# Altium project EncoderBoard2021.PrjPCB
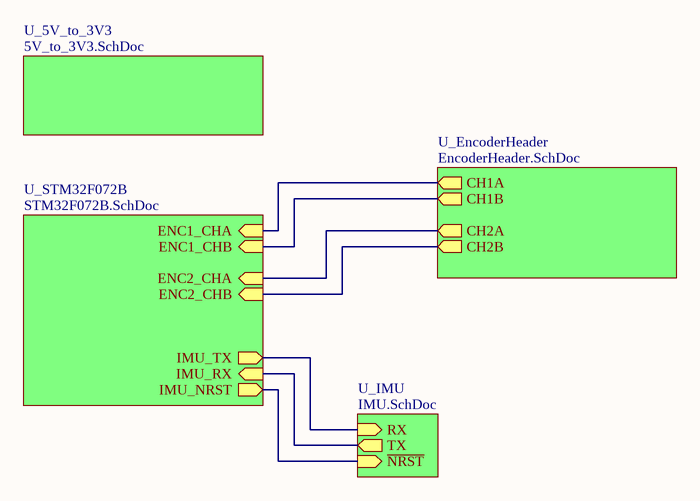
[diagram p0: EncoderBoard2020.SchDoc]
5 sheets, 39 parts. Net scope: hierarchical (ports join the sheet entries above them; power ports are global).
Board files: ENCBoard_rectangle.PcbDoc, pcb1.PcbDoc
Sheets:
  EncoderBoard2020.SchDoc
    U_5V_to_3V3 = 5V_to_3V3.SchDoc
    U_STM32F072B = STM32F072B.SchDoc
    U_EncoderHeader = EncoderHeader.SchDoc
    U_IMU = IMU.SchDoc

## Sheet EncoderBoard2020.SchDoc
size A4

### Sub-sheets
U_5V_to_3V3 = 5V_to_3V3.SchDoc: no entries
U_EncoderHeader = EncoderHeader.SchDoc: CH1B (out), CH1A (out), CH2B (out), CH2A (out)
U_IMU = IMU.SchDoc: TX (out), RX (in), ~{NRST} (in)
U_STM32F072B = STM32F072B.SchDoc: ENC1_CHA (in), ENC1_CHB (in), ENC2_CHA (in), ENC2_CHB (in), IMU_NRST (out), IMU_RX (in), IMU_TX (out)

### Nets
ENC1_CHA: sheet U_STM32F072B/ENC1_CHA, sheet U_EncoderHeader/CH1A
ENC1_CHB: sheet U_STM32F072B/ENC1_CHB, sheet U_EncoderHeader/CH1B
ENC2_CHA: sheet U_STM32F072B/ENC2_CHA, sheet U_EncoderHeader/CH2A
ENC2_CHB: sheet U_STM32F072B/ENC2_CHB, sheet U_EncoderHeader/CH2B
~{NRST}: sheet U_STM32F072B/IMU_NRST, sheet U_IMU/~{NRST}
UART2_RX: sheet U_STM32F072B/IMU_RX, sheet U_IMU/TX
UART2_TX: sheet U_STM32F072B/IMU_TX, sheet U_IMU/RX

## Sheet 5V_to_3V3.SchDoc
size A4
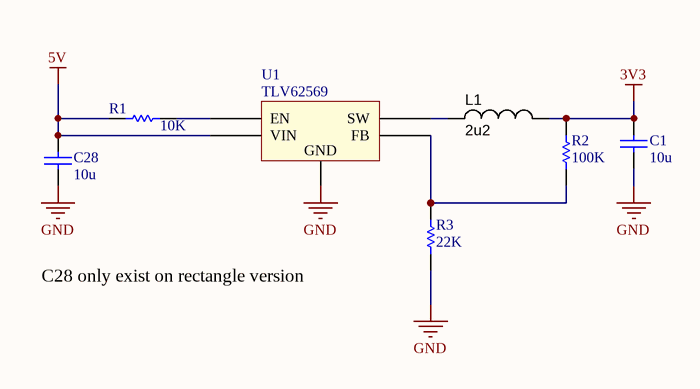
[diagram p1: 5V_to_3V3.SchDoc]

### Parts
C1  value 10u  [CAPC2012X135N]  (hidden comment: Cap)
C28  value 10u  [CAPC2012X135N]  (hidden comment: Cap)
L1  value 2u2  [INDM3225X240N]  (hidden comment: inductor)
R1  value 10K  [RESC1608X55N]  (hidden comment: Res1)
R2  value 100K  [RESC2012X70N]  (hidden comment: Res1)
R3  value 22K  [RESC2012X70N]  (hidden comment: Res1)
U1  TLV62569  [SOT23-5]

### Nets
3V3: C1.2 L1.2 R2.2
5V: C28.2 R1.1 U1.4(VIN)
GND: C1.1 C28.1 R3.2 U1.2(GND)
NetL1_1: L1.1 U1.3(SW)
NetR1_2: R1.2 U1.1(EN)
NetR2_1: R2.1 R3.1 U1.5(FB)

### Notes on the sheet
- C28 only exist on rectangle version

### Library data of the parts
C1 C28 = Cap: Capacitor; Published: 8-Jun-2000; LatestRevisionDate: 17-Jul-2002; LatestRevisionNote: Re-released for DXP Platform.; PackageReference: RAD-0.3; Publisher: Altium Limited; PackageDescription: Radial Cap, Thru-Hole; 2 Leads; 0.3 in Pin Spacing
L1 = INDC: IHLP SMD 4040; link: http://www.mouser.hk/ProductDetail/Panasonic/ETQ-P5M4R7YFC/?qs=sGAEpiMZZMsg%252by3WlYCkUx1BJssUTVH58rrEHsPkNus%3d
R1-R3 = Res1: Resistor; Published: 8-Jun-2000; LatestRevisionDate: 17-Jul-2002; LatestRevisionNote: Re-released for DXP Platform.; PackageReference: AXIAL-0.3; Publisher: Altium Limited; PackageDescription: Axial Device, Thru-Hole; 2 Leads; 0.3 in Pin Spacing
U1 = TLV62569: 2-A High Efficiency Synchronous Buck Converter in SOT Package; Manufacturer: TI; Vin: 2.5-5.5V; Iout(max): 2A

## Sheet STM32F072B.SchDoc
size A4
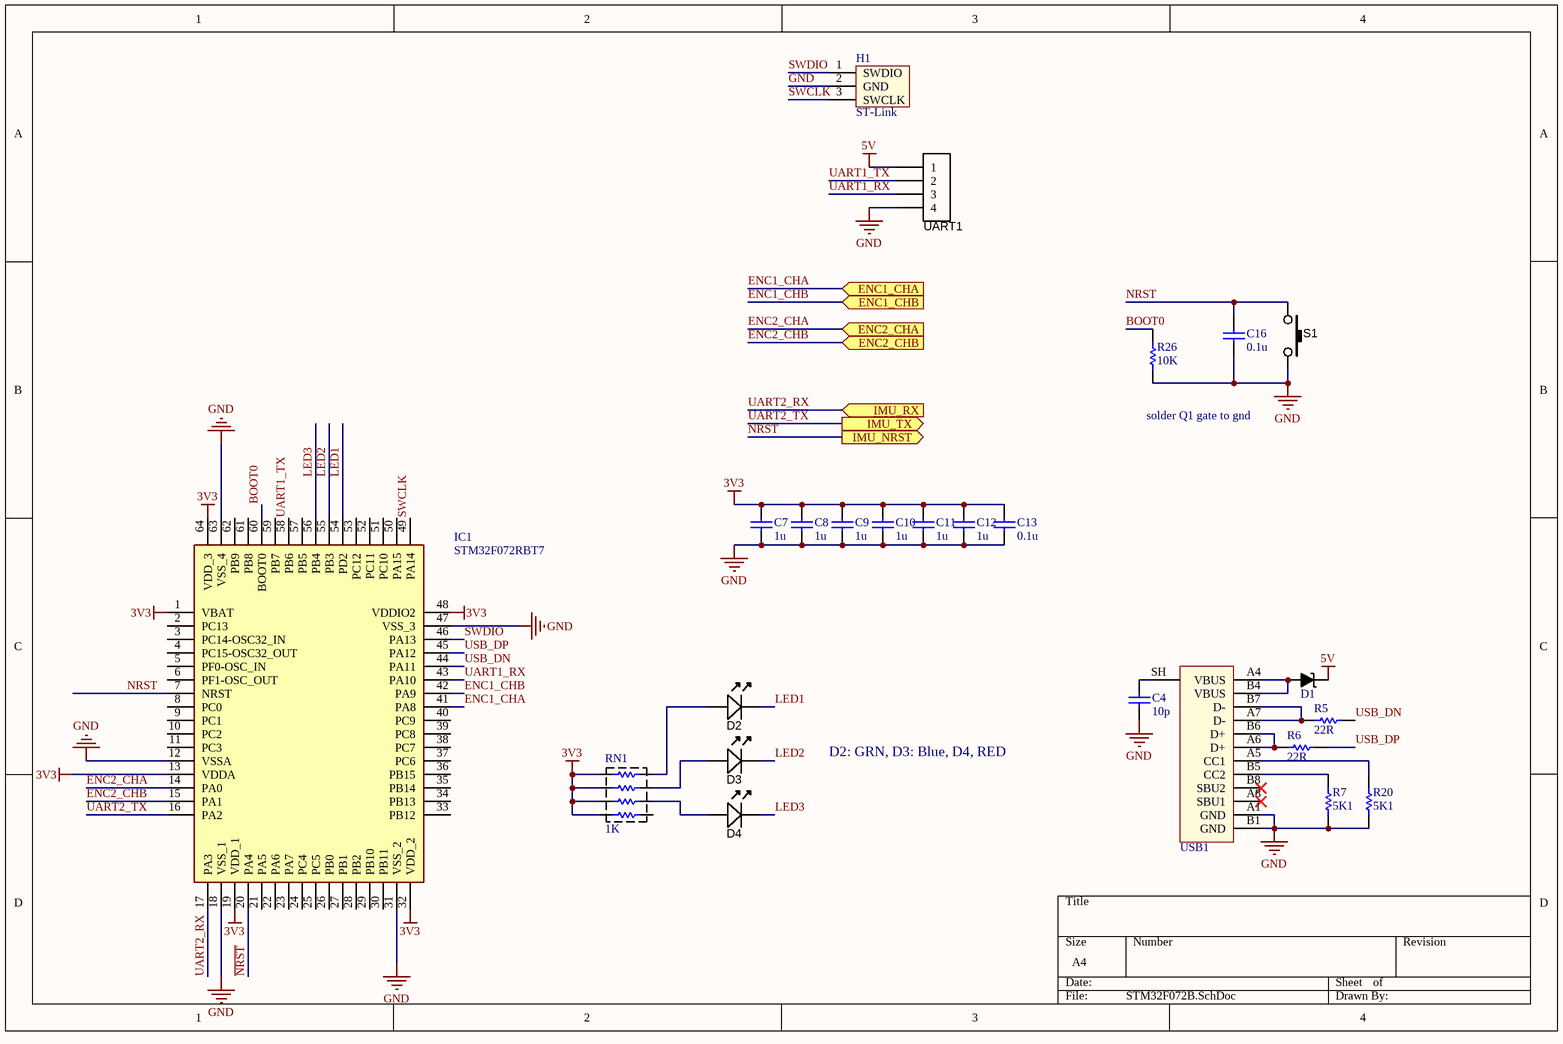
[diagram p2: STM32F072B.SchDoc]

### Parts
C4  value 10p  [CAPC1608X90N]  (hidden comment: Cap)
C7  value 1u  [CAPC1608X90N]  (hidden comment: Cap)
C8  value 1u  [CAPC1608X90N]  (hidden comment: Cap)
C9  value 1u  [CAPC1608X90N]  (hidden comment: Cap)
C10  value 1u  [CAPC1608X90N]  (hidden comment: Cap)
C11  value 1u  [CAPC1608X90N]  (hidden comment: Cap)
C12  value 1u  [CAPC1608X90N]  (hidden comment: Cap)
C13  value 0.1u  [CAPC1608X90N]  (hidden comment: Cap)
C16  value 0.1u  [CAPC1608X90N]  (hidden comment: Cap)
D1  diode  [DIODE_3216_70N]  (value not drawn)
D2  LED_Green_GullWing  [LED-0805-A]  (value not drawn)
D3  LED_Green_GullWing  [LED-0805-A]  (value not drawn)
D4  LED_Green_GullWing  [LED-0805-A]  (value not drawn)
H1  ST-Link  [ST-Link]
IC1  STM32F072RBT7  [QFP50P1200X1200X160-64N]
R5  value 22R  [RESC1608X55N]  (hidden comment: Res1)
R6  value 22R  [RESC1608X55N]  (hidden comment: Res1)
R7  value 5K1  [RESC1608X55N]  (hidden comment: Res1)
R20  value 5K1  [RESC1608X55N]  (hidden comment: Res1)
R26  value 10K  [RESC1608X55N]  (hidden comment: Res1)
RN1  value 1K  [RESCAXS50P160X320X70-8N]  (hidden comment: resistor network)
S1  SW_THT_PB_4.3mm  [TACT_SWT-SMD-4.4]  (value not drawn)
UART1  Programmer  [HDR1X4_2.54MMP]  (value not drawn)  (no BOM)
USB1  USB type C connector  [TYPE-C-31-M-12]  (value not drawn)

### Ports
ENC1_CHA (in), ENC1_CHB (in), ENC2_CHA (in), ENC2_CHB (in), IMU_NRST (out), IMU_RX (in), IMU_TX (out)

### Nets
3V3: C7.2 C8.2 C9.2 C10.2 C11.2 C12.2 C13.2 IC1.1(VBAT) IC1.13(VDDA) IC1.19(VDD_1) IC1.32(VDD_2) IC1.48(VDDIO2) IC1.64(VDD_3) RN1.1 RN1.2 RN1.3 RN1.4
5V: D1.K(Cathode) UART1.1
GND: C4.1 C7.1 C8.1 C9.1 C10.1 C11.1 C12.1 C13.1 C16.1 H1.2(GND) IC1.12(VSSA) IC1.18(VSS_1) IC1.31(VSS_2) IC1.47(VSS_3) IC1.63(VSS_4) R7.1 R20.1 R26.1 S1.2 UART1.4 USB1.A1(GND) USB1.B1(GND)
BOOT0: IC1.60(BOOT0) R26.2
ENC1_CHA: IC1.41(PA8) ; port ENC1_CHA
ENC1_CHB: IC1.42(PA9) ; port ENC1_CHB
ENC2_CHA: IC1.14(PA0) ; port ENC2_CHA
ENC2_CHB: IC1.15(PA1) ; port ENC2_CHB
LED1: D2.K IC1.54(PD2)
LED2: D3.K IC1.55(PB3)
LED3: D4.K IC1.56(PB4)
~{NRST}: IC1.20(PA4) ; port IMU_NRST
NRST: C16.2 IC1.7(NRST) S1.1
SWCLK: H1.3(SWCLK) IC1.49(PA14)
SWDIO: H1.1(SWDIO) IC1.46(PA13)
UART1_RX: IC1.43(PA10) UART1.3
UART1_TX: IC1.58(PB6) UART1.2
UART2_RX: IC1.17(PA3) ; port IMU_RX
UART2_TX: IC1.16(PA2) ; port IMU_TX
USB_DN: IC1.44(PA11) R5.2
USB_DP: IC1.45(PA12) R6.2
NetC4_2: C4.2 USB1.SH
NetD1_A: D1.A(Anode) USB1.A4(VBUS) USB1.B4(VBUS)
NetD2_A: D2.A RN1.8
NetD3_A: D3.A RN1.7
NetD4_A: D4.A RN1.6
NetR5_1: R5.1 USB1.A7(D-) USB1.B7(D-)
NetR6_1: R6.1 USB1.A6(D+) USB1.B6(D+)
NetR7_2: R7.2 USB1.B5(CC2)
NetR20_2: R20.2 USB1.A5(CC1)

Not connected (* = marked no-connect by the designer): IC1 2(PC13) 3(PC14-OSC32_IN) 4(PC15-OSC32_OUT) 5(PF0-OSC_IN) 6(PF1-OSC_OUT) 8(PC0) 9(PC1) 10(PC2) 11(PC3) 21(PA5) 22(PA6) 23(PA7) 24(PC4) 25(PC5) 26(PB0) 27(PB1) 28(PB2) 29(PB10) 30(PB11) 33(PB12) 34(PB13) 35(PB14) 36(PB15) 37(PC6) 38(PC7) 39(PC8) 40(PC9) 50(PA15) 51(PC10) 52(PC11) 53(PC12) 57(PB5) 59(PB7) 61(PB8) 62(PB9); RN1 5; USB1 A8(SBU1)* B8(SBU2)*

### Notes on the sheet
- solder Q1 gate to gnd
- D2: GRN, D3: Blue, D4, RED

### Library data of the parts
C4 C7-C13 C16 = Cap: Capacitor; Published: 8-Jun-2000; LatestRevisionDate: 17-Jul-2002; LatestRevisionNote: Re-released for DXP Platform.; PackageReference: RAD-0.3; Publisher: Altium Limited; PackageDescription: Radial Cap, Thru-Hole; 2 Leads; 0.3 in Pin Spacing
D1 = SD1206S040S2R0: 40V 2A; ComponentLink1Description: mouser; ComponentLink1URL: https://www.mouser.hk/ProductDetail/AVX/SD1206S040S2R0?qs=jCA%252BPfw4LHbfEJl0sZ31oA%3D%3D
D2-D4 = LED_Green_GullWing: LED Gull-wing SMD High-intensity Green 450mcd 574nm; Manufacturer 1: Ligitek; Manufacturer Part Number 1: L8UG9033/TR1; Ratings: 450 mcd; 574 nm; Material: AlGaInP; SCDType: source; Package / Case: 4.6mm Gull-Wing; Color: Green
H1 = ST-Link: ST-Link header with silkscreen
IC1 = STM32F072RBT7: Integrated Circuit; Manufacturer_Name: STMicroelectronics; Datasheet Link: https://componentsearchengine.com/Datasheets/1/STM32F072RBT7.pdf; Height: 1.6mm; Manufacturer_Part_Number: STM32F072RBT7; Mouser Part Number: 511-STM32F072RBT7; Mouser Price/Stock: https://www.mouser.co.uk/ProductDetail/STMicroelectronics/STM32F072RBT7?qs=U58vgkJzipSwHgVHrxMqQQ%3D%3D; Arrow Part Number: STM32F072RBT7; Arrow Price/Stock: https://www.arrow.com/en/products/stm32f072rbt7/stmicroelectronics
R5-R7 R20 R26 = Res1: Resistor; Published: 8-Jun-2000; LatestRevisionDate: 17-Jul-2002; LatestRevisionNote: Re-released for DXP Platform.; PackageReference: AXIAL-0.3; Publisher: Altium Limited; PackageDescription: Axial Device, Thru-Hole; 2 Leads; 0.3 in Pin Spacing
RN1 = RES_NET
S1 = SW_THT_PB_4.3mm: Switch, tact, 4.3mm stem; Manufacturer 1: Bond-Tact; Manufacturer Part Number 1: TS-1143-WP-300; SCDType: spec; Function: Speed; Package / Case: 6.5x6.5mm; 4.3mm stem; Material: Brass/Nylon/Ag plating
UART1 = Header4P: Header 4-pin
USB1 = USB_Type_C: ComponentLink1Description: Datasheet; ComponentLink1URL: https://lcsc.com/product-detail/USB-Type-C_Korean-Hroparts-Elec-TYPE-C-31-M-12_C165948.html

## Sheet EncoderHeader.SchDoc
size A4
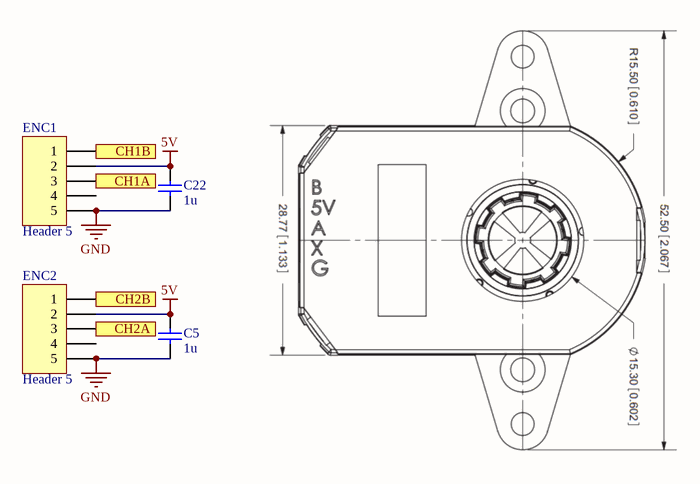
[diagram p3: EncoderHeader.SchDoc]

### Parts
C5  value 1u  [CAPC1608X90N]  (hidden comment: Cap)
C22  value 1u  [CAPC1608X90N]  (hidden comment: Cap)
ENC1  Header 5  [HDR1X5]
ENC2  Header 5  [HDR1X5]

### Ports
CH1A (out), CH1B (out), CH2A (out), CH2B (out)

### Nets
5V: C5.2 C22.2 ENC1.2 ENC2.2
GND: C5.1 C22.1 ENC1.5 ENC2.5
ENC1_CHA: ENC1.3 ; port CH1A
ENC1_CHB: ENC1.1 ; port CH1B
ENC2_CHA: ENC2.3 ; port CH2A
ENC2_CHB: ENC2.1 ; port CH2B

Not connected (* = marked no-connect by the designer): ENC1 4; ENC2 4

### Library data of the parts
C5 C22 = Cap: Capacitor; Published: 8-Jun-2000; LatestRevisionDate: 17-Jul-2002; LatestRevisionNote: Re-released for DXP Platform.; PackageReference: RAD-0.3; Publisher: Altium Limited; PackageDescription: Radial Cap, Thru-Hole; 2 Leads; 0.3 in Pin Spacing
ENC1 ENC2 = Header 5: Header, 5-Pin; LatestRevisionDate: 17-Jul-2002; LatestRevisionNote: Re-released for DXP Platform.; Publisher: Altium Limited

## Sheet IMU.SchDoc
size A4
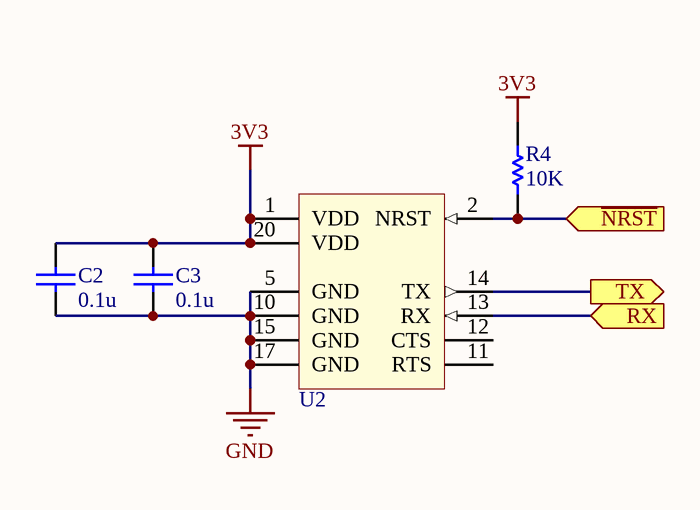
[diagram p4: IMU.SchDoc]

### Parts
C2  value 0.1u  [CAPC1608X90N]  (hidden comment: Cap)
C3  value 0.1u  [CAPC1608X90N]  (hidden comment: Cap)
R4  value 10K  [RESC1608X55N]  (hidden comment: Res1)
U2  LPMS-NAV2  [LPMS-NAV2]  (value not drawn)

### Ports
RX (in), TX (out), ~{NRST} (in)

### Nets
3V3: C2.2 C3.2 R4.2 U2.1(VDD) U2.20(VDD)
GND: C2.1 C3.1 U2.5(GND) U2.10(GND) U2.15(GND) U2.17(GND)
~{NRST}: R4.1 U2.2(NRST) ; port ~{NRST}
UART2_RX: U2.14(TX) ; port TX
UART2_TX: U2.13(RX) ; port RX

Not connected (* = marked no-connect by the designer): U2 11(RTS) 12(CTS)

### Library data of the parts
C2 C3 = Cap: Capacitor; Published: 8-Jun-2000; LatestRevisionDate: 17-Jul-2002; LatestRevisionNote: Re-released for DXP Platform.; PackageReference: RAD-0.3; Publisher: Altium Limited; PackageDescription: Radial Cap, Thru-Hole; 2 Leads; 0.3 in Pin Spacing
R4 = Res1: Resistor; Published: 8-Jun-2000; LatestRevisionDate: 17-Jul-2002; LatestRevisionNote: Re-released for DXP Platform.; PackageReference: AXIAL-0.3; Publisher: Altium Limited; PackageDescription: Axial Device, Thru-Hole; 2 Leads; 0.3 in Pin Spacing
U2 = LPMS-NAV2: ComponentLink1Description: datasheet; ComponentLink1URL: https://www.lp-research.com/wp-content/uploads/2017/11/LPMS-NAV2Manual20171025.pdf; ComponentLink2Description: official website; ComponentLink2URL: https://lp-research.com/lpms-nav2/

## Nets that join several sheets
3V3: 5V_to_3V3 (C1.2 L1.2 R2.2), STM32F072B (17 pins), IMU (5 pins)
5V: 5V_to_3V3 (C28.2 R1.1 U1.4), STM32F072B (D1.K UART1.1), EncoderHeader (C5.2 C22.2 ENC1.2 ENC2.2)
GND: 5V_to_3V3 (C1.1 C28.1 R3.2 U1.2), STM32F072B (22 pins), EncoderHeader (C5.1 C22.1 ENC1.5 ENC2.5), IMU (6 pins)
ENC1_CHA: STM32F072B (IC1.41), EncoderHeader (ENC1.3)
ENC1_CHB: STM32F072B (IC1.42), EncoderHeader (ENC1.1)
ENC2_CHA: STM32F072B (IC1.14), EncoderHeader (ENC2.3)
ENC2_CHB: STM32F072B (IC1.15), EncoderHeader (ENC2.1)
~{NRST}: STM32F072B (IC1.20), IMU (R4.1 U2.2)
UART2_RX: STM32F072B (IC1.17), IMU (U2.14)
UART2_TX: STM32F072B (IC1.16), IMU (U2.13)